# EAGLE schematic double-dice (EAGLE 6.2)
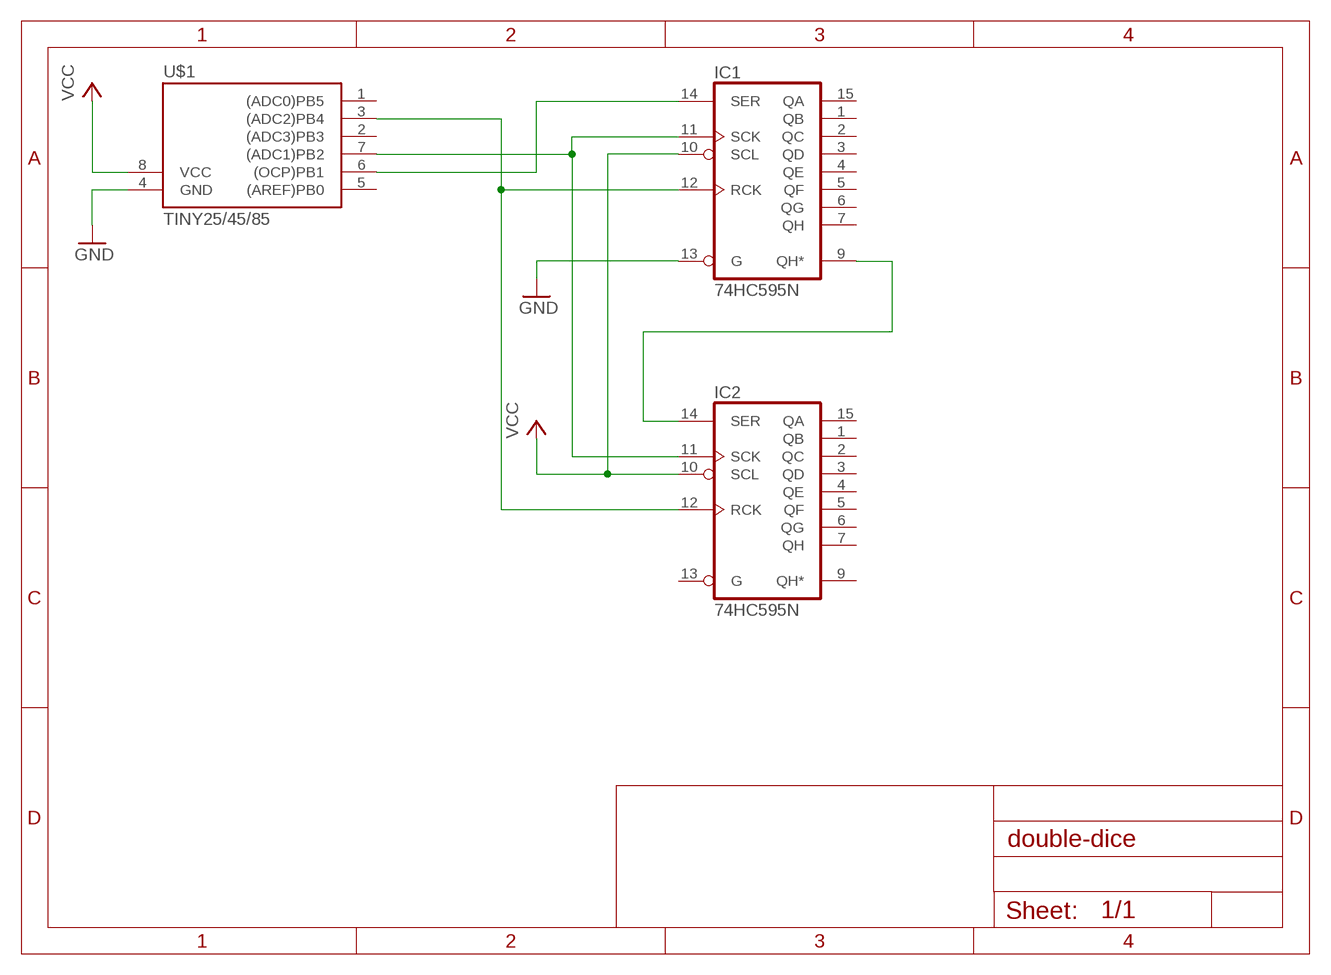
[diagram p0: schematic, sheet 1]

## Parts
IC1  74HC595N  [DIL16]
IC2  74HC595N  [DIL16]
U$1  TINY25/45/85  [DIL08]

## Nets
GND: IC1.13(G) U$1.4(GND)
N$1: IC1.9(QH*) IC2.14(SER)
N$2: IC1.14(SER) U$1.6((OCP)PB1)
N$3: IC1.11(SCK) IC2.11(SCK) U$1.7((ADC1)PB2)
N$4: IC1.12(RCK) IC2.12(RCK) U$1.3((ADC2)PB4)
VCC: IC1.10(SCL) IC2.10(SCL) U$1.8(VCC)
Unconnected: IC1.1(QB) IC1.2(QC) IC1.3(QD) IC1.4(QE) IC1.5(QF) IC1.6(QG) IC1.7(QH) IC1.15(QA) IC2.1(QB) IC2.2(QC) IC2.3(QD) IC2.4(QE) IC2.5(QF) IC2.6(QG) IC2.7(QH) IC2.9(QH*) IC2.13(G) IC2.15(QA) U$1.1((ADC0)PB5) U$1.2((ADC3)PB3) U$1.5((AREF)PB0)

## Power pins joined to a net without a drawn wire
GND: IC1.8(GND) IC2.8(GND)
VCC: IC1.16(VCC) IC2.16(VCC)

## Library data of the parts
IC1 IC2 = 74xx-eu:74*595: 8-bit SHIFT REGISTER, output latch
U$1 = avr-7 ulli:TINY25/45/85